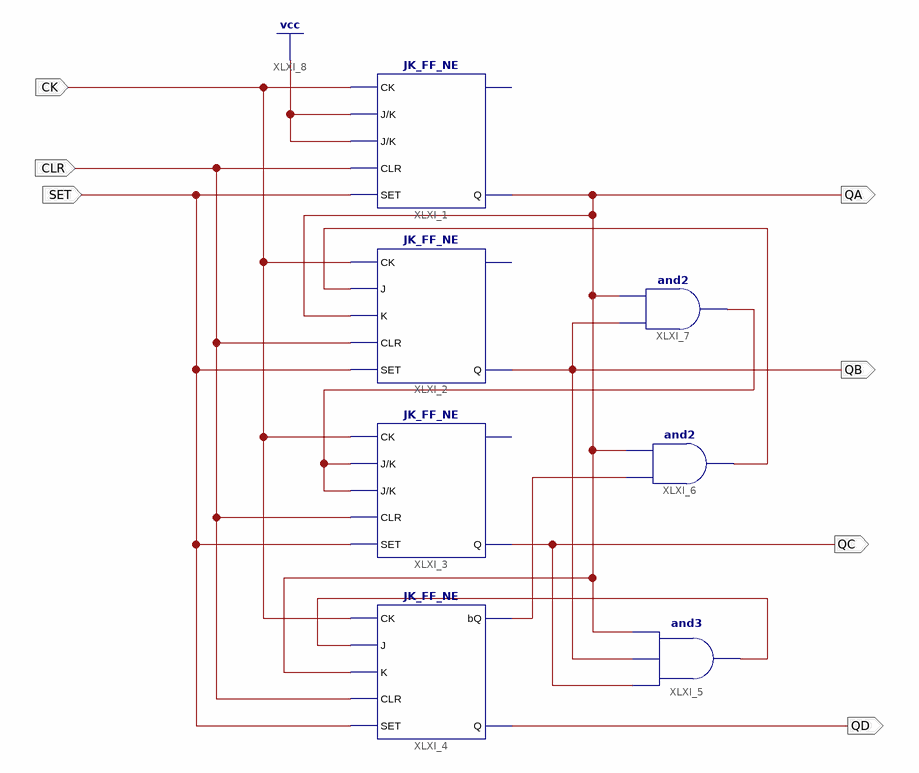
[diagram p0: schematic sheet 1]
// Xilinx ISE schematic Mod10.sch (spartan6) as structural Verilog: 7 symbols, 7 ports
module Mod10 (
  input  CK,
  input  CLR,
  input  SET,
  output QD,
  output QC,
  output QB,
  output QA
);

  wire XLXN_24, XLXN_25, XLXN_29, XLXN_32;

  JK_FF_NE XLXI_1 (.CK(CK), .J(1'b1), .K(1'b1), .CLR(CLR), .SET(SET), .Q(QA));  // open: bQ
  JK_FF_NE XLXI_2 (.CK(CK), .J(XLXN_29), .K(QA), .CLR(CLR), .SET(SET), .Q(QB));  // open: bQ
  JK_FF_NE XLXI_3 (.CK(CK), .J(XLXN_32), .K(XLXN_32), .CLR(CLR), .SET(SET), .Q(QC));  // open: bQ
  JK_FF_NE XLXI_4 (.CK(CK), .J(XLXN_24), .K(QA), .CLR(CLR), .SET(SET), .bQ(XLXN_25), .Q(QD));
  and XLXI_5 (XLXN_24, QC, QB, QA);
  and XLXI_6 (XLXN_29, XLXN_25, QA);
  and XLXI_7 (XLXN_32, QB, QA);
endmodule
